# Altium project DIOT_temperature_logger.PrjPCB (part 1 of 6)
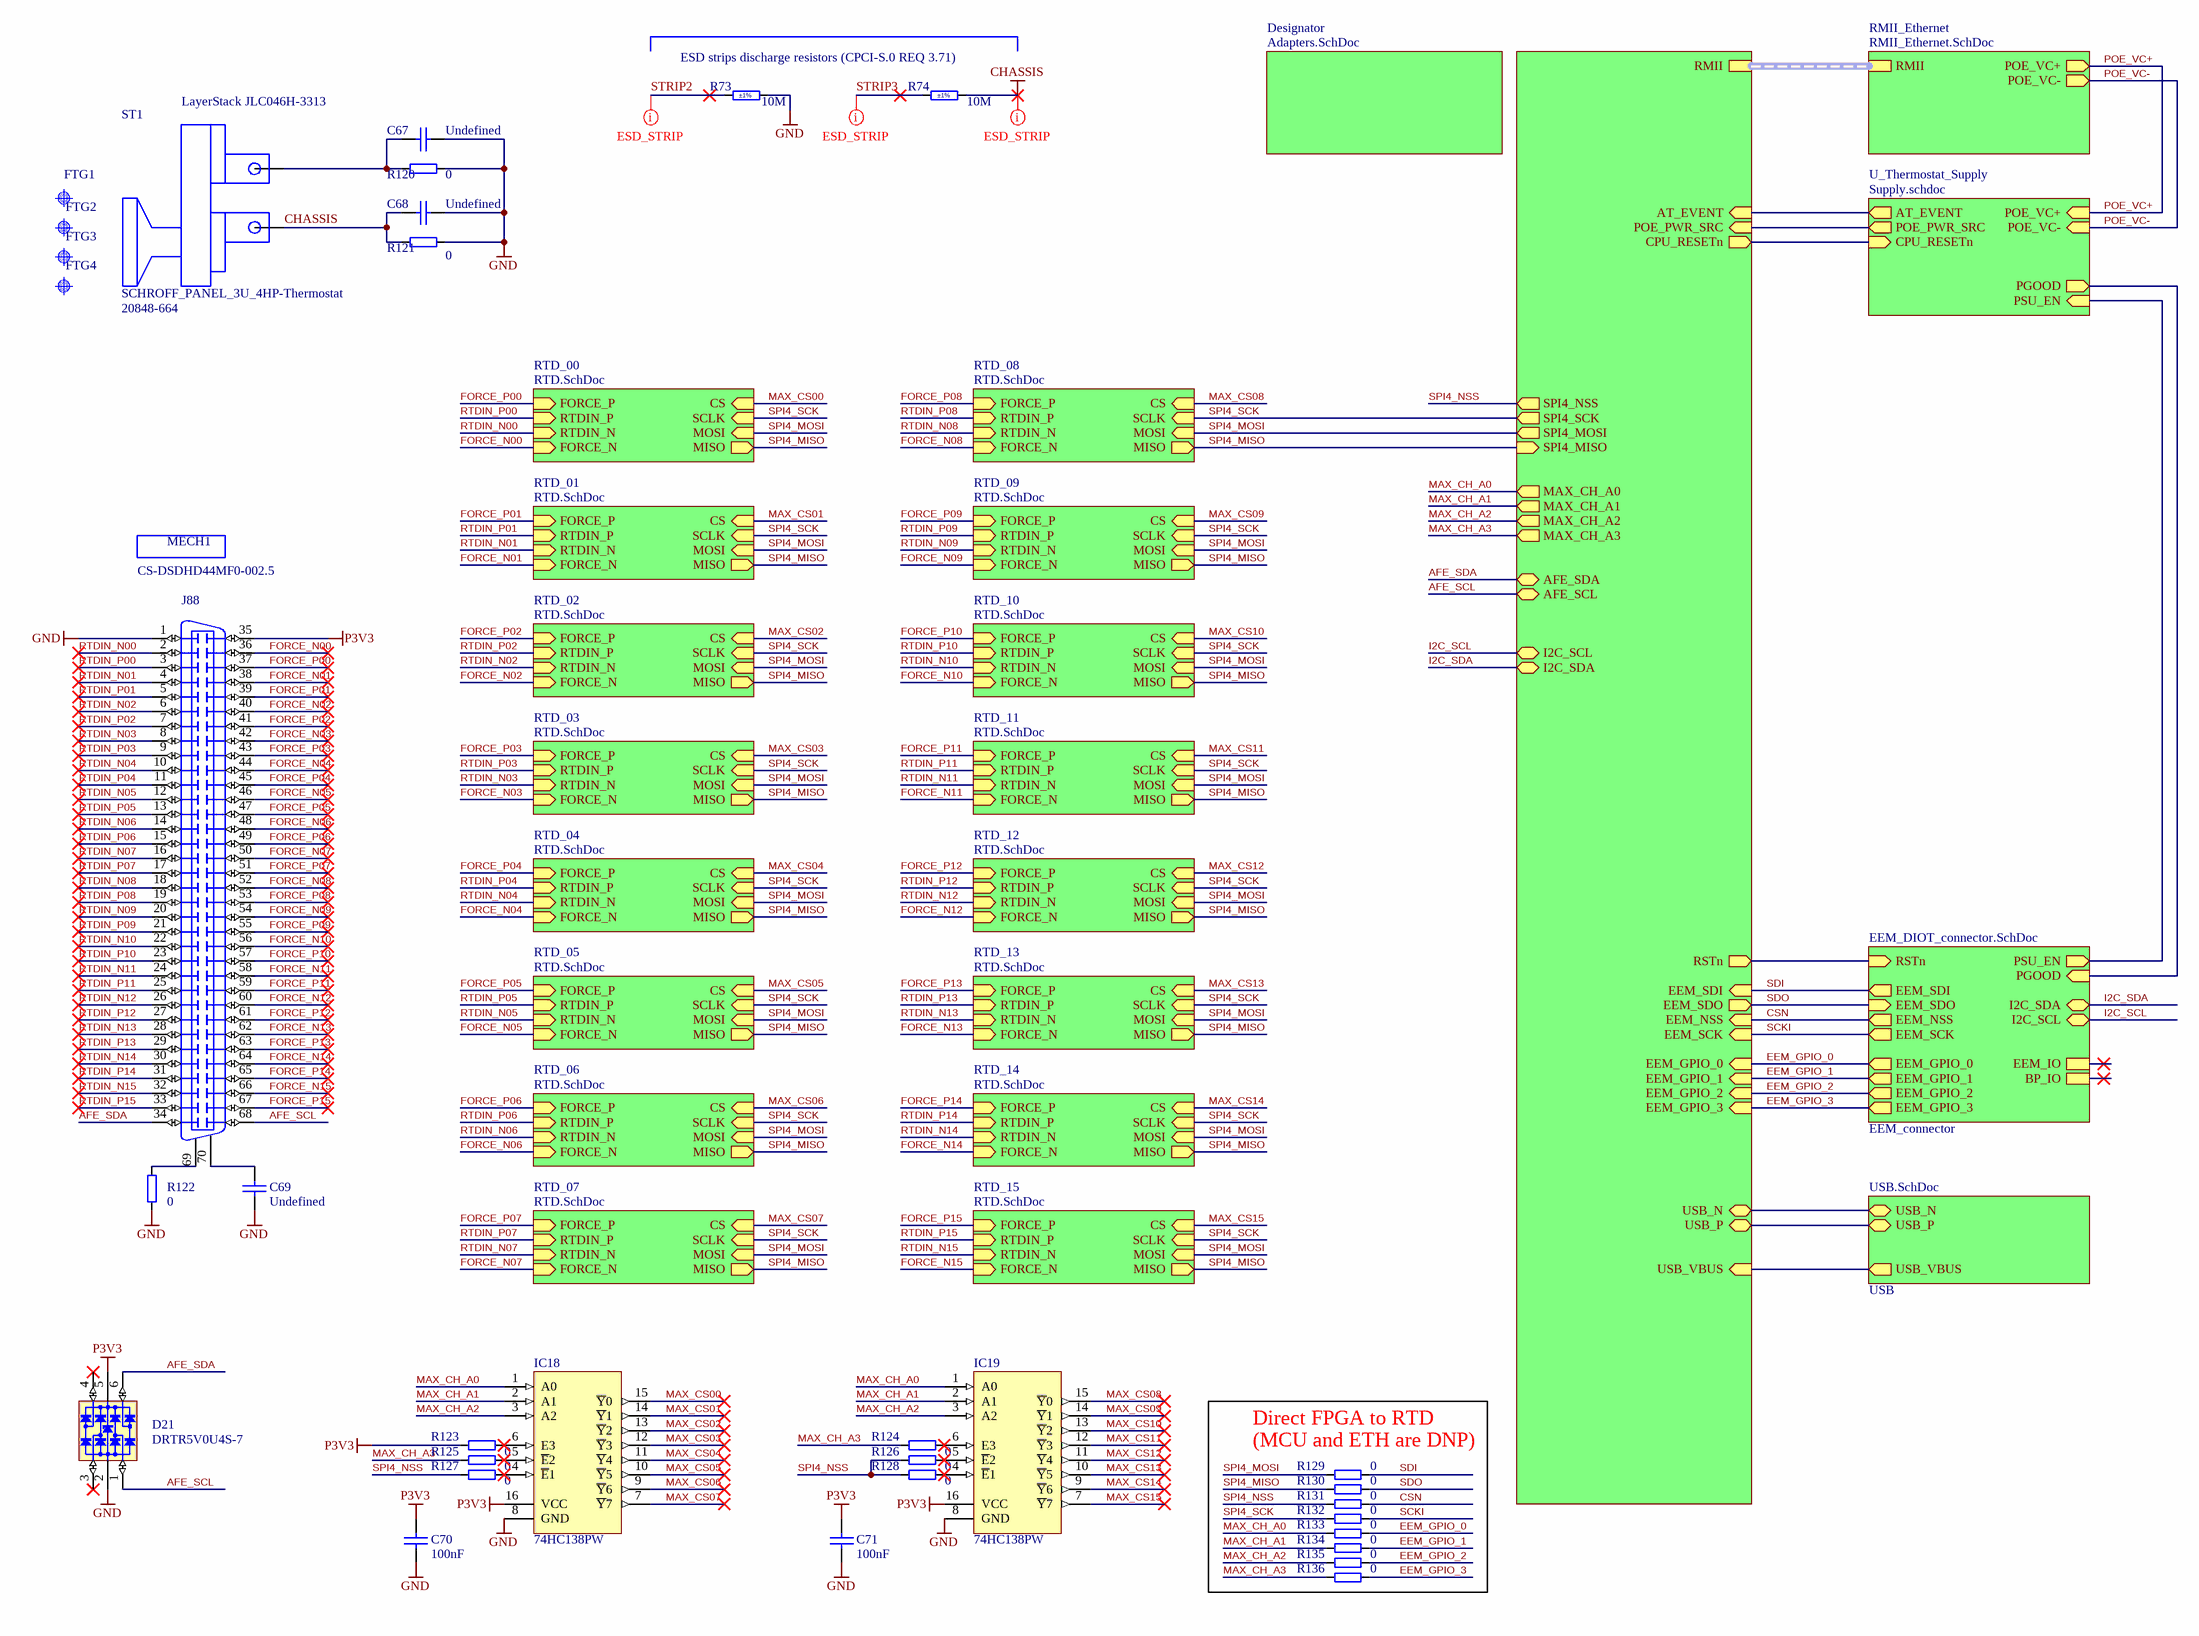
[diagram p0: Thermostat_16CH.SchDoc]
8 sheets, 659 parts. Net scope: hierarchical (ports join the sheet entries above them; power ports are global).
Board files: FrontPanel.PcbDoc, DIOT_temperature_logger.PcbDoc
Sheets:
  Thermostat_16CH.SchDoc
    U_STM32_F4CPU = MCU_STM32F4.SchDoc
    USB = USB.SchDoc
    EEM_connector = EEM_DIOT_connector.SchDoc
    RTD_00 = RTD.SchDoc
    RTD_01 = RTD.SchDoc
    RTD_02 = RTD.SchDoc
    RTD_03 = RTD.SchDoc
    RTD_04 = RTD.SchDoc
    RTD_05 = RTD.SchDoc
    RTD_06 = RTD.SchDoc
    RTD_07 = RTD.SchDoc
    RTD_08 = RTD.SchDoc
    RTD_09 = RTD.SchDoc
    RTD_10 = RTD.SchDoc
    RTD_11 = RTD.SchDoc
    RTD_12 = RTD.SchDoc
    RTD_13 = RTD.SchDoc
    RTD_14 = RTD.SchDoc
    RTD_15 = RTD.SchDoc
    Designator = Adapters.SchDoc
    RMII_Ethernet = RMII_Ethernet.SchDoc
    U_Thermostat_Supply = Supply.schdoc

## Sheet Thermostat_16CH.SchDoc: Thermostat 8CH v1.1
size 420 x 297 mm; CheckedBy: G.Kasprowicz; Author: Ł.Pajak; CompanyName: WUT ISE; DrawnBy: Ł.Pajak; Organization: WUT ISE; Address1: PW ISE; Address2: Nowowiejska 15/19 00-665 Warsaw; Address3: lpajak84@gmail.com; DocumentNumber: 1; Revision: 2; SheetNumber: 1; SheetTotal: 8; ModifiedBy: -; CreateDate: 15.07.2024; Title2: TOP; DivGrp: WUT ISE; Designer: Ł.Pajak; ModifiedDate: -; ProjectName: Sensor Box

### Parts
C67  Undefined  [CAPC2012X135N]
C68  Undefined  [CAPC2012X135N]
C69  Undefined  [CAPC2012X135N]
C70  100nF  [CAPC1608X87N]
C71  100nF  [CAPC1608X87N]
D21  DRTR5V0U4S-7  [SOT65P210X110-6N]
FTG1  Use only in PCB  [FIDUCIAL_TOP_S100-200]  (value not drawn)  (graphical)
FTG2  Use only in PCB  [FIDUCIAL_TOP_S100-200]  (value not drawn)  (graphical)
FTG3  Use only in PCB  [FIDUCIAL_TOP_S100-200]  (value not drawn)  (graphical)
FTG4  Use only in PCB  [FIDUCIAL_TOP_S100-200]  (value not drawn)  (graphical)
IC18  74HC138PW  [SOP65P640X110-16N]
IC19  74HC138PW  [SOP65P640X110-16N]
J88  DNP  [MOLEX_71430-0013]  (value not drawn)
MECH1  CS-DSDHD44MF0-002.5  (mechanical)
R73  10M  Tolerance: ±1%  [RESC1608X55N]
R74  10M  Tolerance: ±1%  [RESC1608X55N]
R120  0  [RESC1608X55N]
R121  0  [RESC1608X55N]
R122  0  [RESC1608X55N]
R123  0  [RESC1608X55N]
R124  0  [RESC1608X55N]
R125  0  [RESC1608X55N]
R126  0  [RESC1608X55N]
R127  0  [RESC1608X55N]
R128  0  [RESC1608X55N]
R129  0  [RESC1608X55N]
R130  0  [RESC1608X55N]
R131  0  [RESC1608X55N]
R132  0  [RESC1608X55N]
R133  0  [RESC1608X55N]
R134  0  [RESC1608X55N]
R135  0  [RESC1608X55N]
R136  0  [RESC1608X55N]
ST1  SCHROFF_PANEL_3U_4HP-Thermostat  Manufacturer Part Number 2: 20848-664  [SCHROFF_PANEL_3HP_4U - Thermostat]

### Sub-sheets
Designator = Adapters.SchDoc: no entries
EEM_connector = EEM_DIOT_connector.SchDoc: I2C_SDA (bidir), I2C_SCL (bidir), EEM_GPIO_0 (out), EEM_GPIO_1 (out), EEM_GPIO_2 (out), EEM_GPIO_3 (out), EEM_SCK (out), EEM_SDI (out), EEM_NSS (out), EEM_SDO (in), EEM_IO (harness EEM_LVDS), BP_IO (harness BP_IO), PSU_EN (out), PGOOD (in), RSTn (in)
RMII_Ethernet = RMII_Ethernet.SchDoc: POE_VC+ (out), POE_VC- (out), RMII (harness PHY_ETH)
RTD_00 = RTD.SchDoc: SCLK (in), MOSI (in), CS (in), MISO (out), RTDIN_P (in), RTDIN_N (in), FORCE_P (in), FORCE_N (in)
RTD_01 = RTD.SchDoc: SCLK (in), MOSI (in), CS (in), MISO (out), RTDIN_P (in), RTDIN_N (in), FORCE_P (in), FORCE_N (in)
RTD_02 = RTD.SchDoc: SCLK (in), MOSI (in), CS (in), MISO (out), RTDIN_P (in), RTDIN_N (in), FORCE_P (in), FORCE_N (in)
RTD_03 = RTD.SchDoc: SCLK (in), MOSI (in), CS (in), MISO (out), RTDIN_P (in), RTDIN_N (in), FORCE_P (in), FORCE_N (in)
RTD_04 = RTD.SchDoc: SCLK (in), MOSI (in), CS (in), MISO (out), RTDIN_P (in), RTDIN_N (in), FORCE_P (in), FORCE_N (in)
RTD_05 = RTD.SchDoc: SCLK (in), MOSI (in), CS (in), MISO (out), RTDIN_P (in), RTDIN_N (in), FORCE_P (in), FORCE_N (in)
RTD_06 = RTD.SchDoc: SCLK (in), MOSI (in), CS (in), MISO (out), RTDIN_P (in), RTDIN_N (in), FORCE_P (in), FORCE_N (in)
RTD_07 = RTD.SchDoc: SCLK (in), MOSI (in), CS (in), MISO (out), RTDIN_P (in), RTDIN_N (in), FORCE_P (in), FORCE_N (in)
RTD_08 = RTD.SchDoc: SCLK (in), MOSI (in), CS (in), MISO (out), RTDIN_P (in), RTDIN_N (in), FORCE_P (in), FORCE_N (in)
RTD_09 = RTD.SchDoc: SCLK (in), MOSI (in), CS (in), MISO (out), RTDIN_P (in), RTDIN_N (in), FORCE_P (in), FORCE_N (in)
RTD_10 = RTD.SchDoc: SCLK (in), MOSI (in), CS (in), MISO (out), RTDIN_P (in), RTDIN_N (in), FORCE_P (in), FORCE_N (in)
RTD_11 = RTD.SchDoc: SCLK (in), MOSI (in), CS (in), MISO (out), RTDIN_P (in), RTDIN_N (in), FORCE_P (in), FORCE_N (in)
RTD_12 = RTD.SchDoc: SCLK (in), MOSI (in), CS (in), MISO (out), RTDIN_P (in), RTDIN_N (in), FORCE_P (in), FORCE_N (in)
RTD_13 = RTD.SchDoc: SCLK (in), MOSI (in), CS (in), MISO (out), RTDIN_P (in), RTDIN_N (in), FORCE_P (in), FORCE_N (in)
RTD_14 = RTD.SchDoc: SCLK (in), MOSI (in), CS (in), MISO (out), RTDIN_P (in), RTDIN_N (in), FORCE_P (in), FORCE_N (in)
RTD_15 = RTD.SchDoc: SCLK (in), MOSI (in), CS (in), MISO (out), RTDIN_P (in), RTDIN_N (in), FORCE_P (in), FORCE_N (in)
U_STM32_F4CPU = MCU_STM32F4.SchDoc: USB_N (bidir), USB_P (bidir), USB_VBUS (in), EEM_SDI (in), EEM_SDO (out), EEM_NSS (in), EEM_SCK (in), EEM_GPIO_0 (in), EEM_GPIO_1 (in), SPI4_NSS (out), SPI4_SCK (out), SPI4_MISO (in), SPI4_MOSI (out), MAX_CH_A0 (out), MAX_CH_A1 (out), MAX_CH_A2 (out), MAX_CH_A3 (out), AFE_SCL (bidir), AFE_SDA (bidir), POE_PWR_SRC (in), CPU_RESETn (out), AT_EVENT (in), I2C_SCL (bidir), I2C_SDA (bidir), EEM_GPIO_2 (in), EEM_GPIO_3 (in), RMII (harness PHY_ETH), RSTn (out)
U_Thermostat_Supply = Supply.schdoc: POE_VC+ (in), POE_VC- (in), AT_EVENT (out), CPU_RESETn (in), POE_PWR_SRC (out), PGOOD (out), PSU_EN (in)
USB = USB.SchDoc: USB_VBUS (out), USB_N (bidir), USB_P (bidir)

### Nets
CHASSIS: C68.1 R74.2 R121.2 ST1.0
GND: C67.2 C68.2 C69.1 C70.1 C71.1 D21.2(GND) IC18.8(GND) IC19.8(GND) J88.1 R73.2 R120.1 R121.1 R122.2
P3V3: C70.2 C71.2 D21.5(VBUS) IC18.16(VCC) IC19.16(VCC) J88.35 R123.1
AFE_SCL: D21.1(I/O1) J88.68 ; sheet U_STM32_F4CPU/AFE_SCL
AFE_SDA: D21.6(I/O4) J88.34 ; sheet U_STM32_F4CPU/AFE_SDA
AT_EVENT: sheet U_STM32_F4CPU/AT_EVENT, sheet U_Thermostat_Supply/AT_EVENT
CPU_RESETn: sheet U_STM32_F4CPU/CPU_RESETn, sheet U_Thermostat_Supply/CPU_RESETn
CSN: R131.2 ; sheet U_STM32_F4CPU/EEM_NSS, sheet EEM_connector/EEM_NSS
EEM_GPIO_0: R133.2 ; sheet U_STM32_F4CPU/EEM_GPIO_0, sheet EEM_connector/EEM_GPIO_0
EEM_GPIO_1: R134.2 ; sheet U_STM32_F4CPU/EEM_GPIO_1, sheet EEM_connector/EEM_GPIO_1
EEM_GPIO_2: R135.2 ; sheet U_STM32_F4CPU/EEM_GPIO_2, sheet EEM_connector/EEM_GPIO_2
EEM_GPIO_3: R136.2 ; sheet U_STM32_F4CPU/EEM_GPIO_3, sheet EEM_connector/EEM_GPIO_3
FORCE_N00: J88.36 ; sheet RTD_00/FORCE_N
FORCE_N01: J88.38 ; sheet RTD_01/FORCE_N
FORCE_N02: J88.40 ; sheet RTD_02/FORCE_N
FORCE_N03: J88.42 ; sheet RTD_03/FORCE_N
FORCE_N04: J88.44 ; sheet RTD_04/FORCE_N
FORCE_N05: J88.46 ; sheet RTD_05/FORCE_N
FORCE_N06: J88.48 ; sheet RTD_06/FORCE_N
FORCE_N07: J88.50 ; sheet RTD_07/FORCE_N
FORCE_N08: J88.52 ; sheet RTD_08/FORCE_N
FORCE_N09: J88.54 ; sheet RTD_09/FORCE_N
FORCE_N10: J88.56 ; sheet RTD_10/FORCE_N
FORCE_N11: J88.58 ; sheet RTD_11/FORCE_N
FORCE_N12: J88.60 ; sheet RTD_12/FORCE_N
FORCE_N13: J88.62 ; sheet RTD_13/FORCE_N
FORCE_N14: J88.64 ; sheet RTD_14/FORCE_N
FORCE_N15: J88.66 ; sheet RTD_15/FORCE_N
FORCE_P00: J88.37 ; sheet RTD_00/FORCE_P
FORCE_P01: J88.39 ; sheet RTD_01/FORCE_P
FORCE_P02: J88.41 ; sheet RTD_02/FORCE_P
FORCE_P03: J88.43 ; sheet RTD_03/FORCE_P
FORCE_P04: J88.45 ; sheet RTD_04/FORCE_P
FORCE_P05: J88.47 ; sheet RTD_05/FORCE_P
FORCE_P06: J88.49 ; sheet RTD_06/FORCE_P
FORCE_P07: J88.51 ; sheet RTD_07/FORCE_P
FORCE_P08: J88.53 ; sheet RTD_08/FORCE_P
FORCE_P09: J88.55 ; sheet RTD_09/FORCE_P
FORCE_P10: J88.57 ; sheet RTD_10/FORCE_P
FORCE_P11: J88.59 ; sheet RTD_11/FORCE_P
FORCE_P12: J88.61 ; sheet RTD_12/FORCE_P
FORCE_P13: J88.63 ; sheet RTD_13/FORCE_P
FORCE_P14: J88.65 ; sheet RTD_14/FORCE_P
FORCE_P15: J88.67 ; sheet RTD_15/FORCE_P
I2C_SCL: sheet U_STM32_F4CPU/I2C_SCL, sheet EEM_connector/I2C_SCL
I2C_SDA: sheet U_STM32_F4CPU/I2C_SDA, sheet EEM_connector/I2C_SDA
MAX_CH_A0: IC18.1(A0) IC19.1(A0) R133.1 ; sheet U_STM32_F4CPU/MAX_CH_A0
MAX_CH_A1: IC18.2(A1) IC19.2(A1) R134.1 ; sheet U_STM32_F4CPU/MAX_CH_A1
MAX_CH_A2: IC18.3(A2) IC19.3(A2) R135.1 ; sheet U_STM32_F4CPU/MAX_CH_A2
MAX_CH_A3: R124.1 R125.1 R136.1 ; sheet U_STM32_F4CPU/MAX_CH_A3
MAX_CS00: IC18.15(~{Y}0) ; sheet RTD_00/CS
MAX_CS01: IC18.14(~{Y}1) ; sheet RTD_01/CS
MAX_CS02: IC18.13(~{Y}2) ; sheet RTD_02/CS
MAX_CS03: IC18.12(~{Y}3) ; sheet RTD_03/CS
MAX_CS04: IC18.11(~{Y}4) ; sheet RTD_04/CS
MAX_CS05: IC18.10(~{Y}5) ; sheet RTD_05/CS
MAX_CS06: IC18.9(~{Y}6) ; sheet RTD_06/CS
MAX_CS07: IC18.7(~{Y}7) ; sheet RTD_07/CS
MAX_CS08: IC19.15(~{Y}0) ; sheet RTD_08/CS
MAX_CS09: IC19.14(~{Y}1) ; sheet RTD_09/CS
MAX_CS10: IC19.13(~{Y}2) ; sheet RTD_10/CS
MAX_CS11: IC19.12(~{Y}3) ; sheet RTD_11/CS
MAX_CS12: IC19.11(~{Y}4) ; sheet RTD_12/CS
MAX_CS13: IC19.10(~{Y}5) ; sheet RTD_13/CS
MAX_CS14: IC19.9(~{Y}6) ; sheet RTD_14/CS
MAX_CS15: IC19.7(~{Y}7) ; sheet RTD_15/CS
PGOOD: sheet EEM_connector/PGOOD, sheet U_Thermostat_Supply/PGOOD
POE_PWR_SRC: sheet U_STM32_F4CPU/POE_PWR_SRC, sheet U_Thermostat_Supply/POE_PWR_SRC
POE_VC+: sheet RMII_Ethernet/POE_VC+, sheet U_Thermostat_Supply/POE_VC+
POE_VC-: sheet RMII_Ethernet/POE_VC-, sheet U_Thermostat_Supply/POE_VC-
PSU_EN: sheet EEM_connector/PSU_EN, sheet U_Thermostat_Supply/PSU_EN
RSTn: sheet U_STM32_F4CPU/RSTn, sheet EEM_connector/RSTn
RTDIN_N00: J88.2 ; sheet RTD_00/RTDIN_N
RTDIN_N01: J88.4 ; sheet RTD_01/RTDIN_N
RTDIN_N02: J88.6 ; sheet RTD_02/RTDIN_N
RTDIN_N03: J88.8 ; sheet RTD_03/RTDIN_N
RTDIN_N04: J88.10 ; sheet RTD_04/RTDIN_N
RTDIN_N05: J88.12 ; sheet RTD_05/RTDIN_N
RTDIN_N06: J88.14 ; sheet RTD_06/RTDIN_N
RTDIN_N07: J88.16 ; sheet RTD_07/RTDIN_N
RTDIN_N08: J88.18 ; sheet RTD_08/RTDIN_N
RTDIN_N09: J88.20 ; sheet RTD_09/RTDIN_N
RTDIN_N10: J88.22 ; sheet RTD_10/RTDIN_N
RTDIN_N11: J88.24 ; sheet RTD_11/RTDIN_N
RTDIN_N12: J88.26 ; sheet RTD_12/RTDIN_N
RTDIN_N13: J88.28 ; sheet RTD_13/RTDIN_N
RTDIN_N14: J88.30 ; sheet RTD_14/RTDIN_N
RTDIN_N15: J88.32 ; sheet RTD_15/RTDIN_N
RTDIN_P00: J88.3 ; sheet RTD_00/RTDIN_P
RTDIN_P01: J88.5 ; sheet RTD_01/RTDIN_P
RTDIN_P02: J88.7 ; sheet RTD_02/RTDIN_P
RTDIN_P03: J88.9 ; sheet RTD_03/RTDIN_P
RTDIN_P04: J88.11 ; sheet RTD_04/RTDIN_P
RTDIN_P05: J88.13 ; sheet RTD_05/RTDIN_P
RTDIN_P06: J88.15 ; sheet RTD_06/RTDIN_P
RTDIN_P07: J88.17 ; sheet RTD_07/RTDIN_P
RTDIN_P08: J88.19 ; sheet RTD_08/RTDIN_P
RTDIN_P09: J88.21 ; sheet RTD_09/RTDIN_P
RTDIN_P10: J88.23 ; sheet RTD_10/RTDIN_P
RTDIN_P11: J88.25 ; sheet RTD_11/RTDIN_P
RTDIN_P12: J88.27 ; sheet RTD_12/RTDIN_P
RTDIN_P13: J88.29 ; sheet RTD_13/RTDIN_P
RTDIN_P14: J88.31 ; sheet RTD_14/RTDIN_P
RTDIN_P15: J88.33 ; sheet RTD_15/RTDIN_P
SCKI: R132.2 ; sheet U_STM32_F4CPU/EEM_SCK, sheet EEM_connector/EEM_SCK  [project net EEM_SCK]
SDI: R129.2 ; sheet U_STM32_F4CPU/EEM_SDI, sheet EEM_connector/EEM_SDI  [project net EEM_SDI]
SDO: R130.2 ; sheet U_STM32_F4CPU/EEM_SDO, sheet EEM_connector/EEM_SDO  [project net EEM_SDO]
SPI4_MISO: R130.1 ; sheet U_STM32_F4CPU/SPI4_MISO, sheet RTD_00/MISO, sheet RTD_01/MISO, sheet RTD_02/MISO, sheet RTD_03/MISO, sheet RTD_04/MISO, sheet RTD_05/MISO, sheet RTD_06/MISO, sheet RTD_07/MISO, sheet RTD_08/MISO, sheet RTD_09/MISO, sheet RTD_10/MISO, sheet RTD_11/MISO, sheet RTD_12/MISO, sheet RTD_13/MISO, sheet RTD_14/MISO, sheet RTD_15/MISO
SPI4_MOSI: R129.1 ; sheet U_STM32_F4CPU/SPI4_MOSI, sheet RTD_00/MOSI, sheet RTD_01/MOSI, sheet RTD_02/MOSI, sheet RTD_03/MOSI, sheet RTD_04/MOSI, sheet RTD_05/MOSI, sheet RTD_06/MOSI, sheet RTD_07/MOSI, sheet RTD_08/MOSI, sheet RTD_09/MOSI, sheet RTD_10/MOSI, sheet RTD_11/MOSI, sheet RTD_12/MOSI, sheet RTD_13/MOSI, sheet RTD_14/MOSI, sheet RTD_15/MOSI
SPI4_NSS: R126.1 R127.1 R128.1 R131.1 ; sheet U_STM32_F4CPU/SPI4_NSS
SPI4_SCK: R132.1 ; sheet U_STM32_F4CPU/SPI4_SCK, sheet RTD_00/SCLK, sheet RTD_01/SCLK, sheet RTD_02/SCLK, sheet RTD_03/SCLK, sheet RTD_04/SCLK, sheet RTD_05/SCLK, sheet RTD_06/SCLK, sheet RTD_07/SCLK, sheet RTD_08/SCLK, sheet RTD_09/SCLK, sheet RTD_10/SCLK, sheet RTD_11/SCLK, sheet RTD_12/SCLK, sheet RTD_13/SCLK, sheet RTD_14/SCLK, sheet RTD_15/SCLK  [project net SPI4_CLK]
STRIP2: R73.1
STRIP3: R74.1
USB_N: sheet U_STM32_F4CPU/USB_N, sheet USB/USB_N
USB_P: sheet U_STM32_F4CPU/USB_P, sheet USB/USB_P
USB_VBUS: sheet U_STM32_F4CPU/USB_VBUS, sheet USB/USB_VBUS
NetC67_1: C67.1 R120.2 ST1.1
NetC69_2: C69.2 J88.70
NetIC18_4: IC18.4(~{E}1) R127.2
NetIC18_5: IC18.5(~{E}2) R125.2
NetIC18_6: IC18.6(E3) R123.2
NetIC19_4: IC19.4(~{E}1) R128.2
NetIC19_5: IC19.5(~{E}2) R126.2
NetIC19_6: IC19.6(E3) R124.2
NetJ88_69: J88.69 R122.1

Not connected (* = marked no-connect by the designer): D21 3(I/O2)* 4(I/O3)*

### Buses and harness runs
harness sheet RMII_Ethernet/RMII = sheet U_STM32_F4CPU/RMII

### Layout directives
net class ESD_STRIP: CHASSIS, STRIP2, STRIP3

### Notes on the sheet
- LayerStack JLC046H-3313
- ESD strips discharge resistors (CPCI-S.0 REQ 3.71)
- Direct FPGA to RTD
- (MCU and ETH are DNP)
- Project/Equipment
- Document
- Designer
- Drawn by
- Check.by
- Copyright WUT ISE 2020.
  This documentation describes Open Hardware and is licensed under the CERN OHL v.1.2. You may redistribute and modify this documentation under the terms of the CERN OHL v.1.2. (http://ohwr.org/CERNOHL). This documentation is distributed WITHOUT ANY EXPRESS OR IMPLIED WARRANTY, INCLUDING OF MERCHANTABILITY, SATISFACTORY QUALITY AND FITNESS FOR A PARTICULAR PURPOSE. Please see the CERN OHL v.1.2 for applicable conditions.
- Contact
- File
- Last Mod.
- Print Date
- Sheet
- Size
- A3
- of
- Rev

### Library data of the parts
C67-C69 = CC0805_NO-VALUE: Non-polarised capacitor; Part Description: Reserved Footprint For 0805(2012) Chip Ceramic Capacitor; Mounted: No; Part Number: CC0805_NO-VALUE; Component Kind: Standard; Component Type: Standard; Pin Count: 2; Value: Undefined; Status: None; Manufacturer: Undefined; Manufacturer Part Number: CC0805_NO-VALUE; Case: 0805; Socket: No; SMD: Yes; Sense: No; Manufacturer1 ComponentHeight: 1.35mm; HelpURL: Undefined; Author: CERN DEM JLC; CreateDate: 10.12.2008; LatestRevisionDate: 11.09.2013
C70 C71 = CC0603_100NF_50V_10%_X7R: Non-polarised capacitor; Part Description: SMD Multilayer Chip Ceramic Capacitor; Manufacturer: GENERIC; Manufacturer1 Part Number: 223858615649; Voltage: 50V; TC: X7R; Tolerance: ±10%; Part Number: CC0603_100NF_50V_10%_X7R; Component Kind: Standard; Component Type: Standard; Pin Count: 2; Value: 100nF; Status: Preferred; Manufacturer Part Number: CC0603_100NF_50V_10%_X7R; Case: 0603; Mounted: Yes; Socket: No; SMD: Yes; Sense: No; Manufacturer1 Example: PHYCOMP; Manufacturer1 ComponentHeight: 0.87mm; HelpURL: \\cern.ch\dfs\Applications\Altium\Datasheets\CC0603_X7R_PHYCOMP.pdf; Author: CERN DEM JLC; CreateDate: 03.12.2007; LatestRevisionDate: 03.12.2007
D21 = D_TVS_DRTR5V0U4S-7: Integrated Quad Ultra-Low Capacitance ESD Protection; Part Description: Integrated Quad Ultra-Low Capacitance ESD (±8kV) Protection; Manufacturer: DIODES; PressFit: No; Bonding: No; Status Comment: Active; Part Number: DRTR5V0U4S-7; Component Kind: Standard; Component Type: Standard; Device: DRTR5V0U4S-7; PackageDescription: SOT363, SC70-6, 0.65mm Pitch; 6 Pin, 1.25mm W X 2.00mm L X 1.10mm H body, IPC Medium Density; Status: Active; Manufacturer Part Number: DRTR5V0U4S-7; Pin Count: 6; Case: SOT363; Mounted: Yes; Socket: No; SMD: Yes; Sense: No; ComponentHeight: 1.1mm; HelpURL: \\cern.ch\dfs\Applications\Altium\Datasheets\PRTR5V0U4Y.pdf; Author: GK; CreateDate: 24.01.2017; LatestRevisionDate: 14.09.2020
FTG1-FTG4 = FIDUCIAL_TARGET_S100-200: Fiducial Target; Part Description: Square Fiducial Target, Top Layer, 1.0mm, Top Solder 2.0mm, Keepout =2.0mm; Mounted: No; Part Number: FIDUCIAL_TARGET_S100-200; Component Type: Standard (No BOM); Pin Count: 1; Family: Fiducial; Socket: No; SMD: Yes; Sense: No; Status: None; ComponentHeight: 0mm; HelpURL: Undefined; Author: CERN DEM JLC; CreateDate: 09.02.2010; LatestRevisionDate: 04.04.2012; PackageDescription: Square Fiducial Target, Top Layer, 1.0mm, Top Solder 2.0mm, Keepout =2.0mm
IC18 IC19 = 74HC138PW: 3-Line to 8-Line Decoder/Demultiplexer; Part Description: 3-Line to 8-Line Decoder/Demultiplexer, Inverting; Manufacturer: NXP SEMICONDUCTORS; PressFit: No; Bonding: No; Part Number: 74HC138PW; Component Kind: Standard; Component Type: Standard; Device: 74HC138PW; PackageDescription: SOP, 0.65mm Pitch; 16 Pin, 4.40mm W X 5.00mm L X 1.10mm H body IPC Medium Density; Manufacturer Part Number: 74HC138PW; Pin Count: 16; Case: TSSOP16; Mounted: Yes; Socket: No; SMD: Yes; Sense: No; ComponentHeight: 1.1mm; Author: CERN DEM JLC; HelpURL: \\cern.ch\dfs\Applications\Altium\Datasheets\74HC138PW.pdf; CreateDate: 09.06.2015; LatestRevisionDate: 09.06.2015
J88 = MOLEX_71430-0013: Very High Density Cable Interconnect (VHDCI ) 68 Female; Part Description: 68 Positions, Pitch 0.8mm, Very Hight Density Right Angle Receptacle, VHDCI Standard (Recommended PCB Thickness: 1.6mm); Manufacturer: MOLEX; PressFit: No; Part Number: MOLEX_71430-0013; Component Kind: Standard; Component Type: Standard; Pin Count: 70; Family: VHDCI; Mounted: Yes; Socket: No; SMD: No; Status: None; Manufacturer Part Number: 71430-0013; ComponentHeight: 6.28mm; HelpURL: \\cern.ch\dfs\Applications\Altium\Datasheets\MOLEX_71430-0013.pdf; Author: CERN DEM JLC; CreateDate: 2014-01-30; LatestRevisionDate: 2014-01-30; Table: MOLEX
MECH1 = Generic_mechanical: D-Sub Cables DELUXE HD44 M/F MOLDED 2.5'; Part Description: D-sub44 cable; Manufacturer: Amphenol; PressFit: No; Value: 750mm; Part Number: CS-DSDHD44MF0-002.5; Component Type: Standard; Footprint: generic_MECH; Pin Count: 0; PackageDescription: generic; Mounted: Yes; Socket: No; SMD: No; Sense: No; Status: None; Manufacturer Part Number: CS-DSDHD44MF0-002.5; ComponentHeight: generic; Author: GK; CreateDate: 28.10.2019; LatestRevisionDate: 28.10.2019
R73 R74 = R0603_10M_1%_0.1W_100PPM: Resistor - 1%; Part Description: General Purpose Thick Film Chip Resistor; Manufacturer: GENERIC; Manufacturer1 Part Number: CRCW060310M0FKEA; Power: 0.1W; TC: ±100ppm/°C; PressFit: No; Part Number: R0603_10M_1%_0.1W_100PPM; Component Kind: Standard; Component Type: Standard; Pin Count: 2; Value: 10M; Status: Preferred; Manufacturer Part Number: R0603_10M_1%_0.1W_100PPM; Case: 0603; Mounted: Yes; Sense: No; Socket: No; SMD: Yes; Manufacturer1 Example: VISHAY; Manufacturer1 ComponentHeight: 0.55mm; HelpURL: \\cern.ch\dfs\Applications\Altium\Datasheets\R0603_VISHAY_CRCW e3.pdf; Author: CERN DEM JLC; CreateDate: 12.01.2017; LatestRevisionDate: 12.01.2017
R120-R136 = R0603_0R_JUMPER: Resistor; Part Description: 1A (0.05R Max DC Resistance) Zero Ohm Jumper; Manufacturer: GENERIC; Manufacturer1 Part Number: NRC06Z0; PressFit: No; Part Number: R0603_0R_JUMPER; Component Kind: Standard; Component Type: Standard; Pin Count: 2; Value: 0; Status: Preferred; Manufacturer Part Number: R0603_0R_JUMPER; Case: 0603; Mounted: Yes; Sense: No; Socket: No; SMD: Yes; Manufacturer1 Example: NIC COMPONENT; Manufacturer1 ComponentHeight: 0.55mm; HelpURL: \\cern.ch\dfs\Applications\Altium\Datasheets\R0603_NIC_NRC.pdf; Author: CERN DEM JLC; CreateDate: 03.12.2007; LatestRevisionDate: 13.03.2008
ST1 = SCHROFF_PANEL_3U_4HP_Thermostat: Schroff 3HP 4U EUROCARD Panel; Manufacturer Part Number: 20818-017; Manufacturer: Schroff